# Altium schematic sheet ARCHITECTURE.SchDoc: Architecture
size 420 x 297 mm; SheetNumber: 1
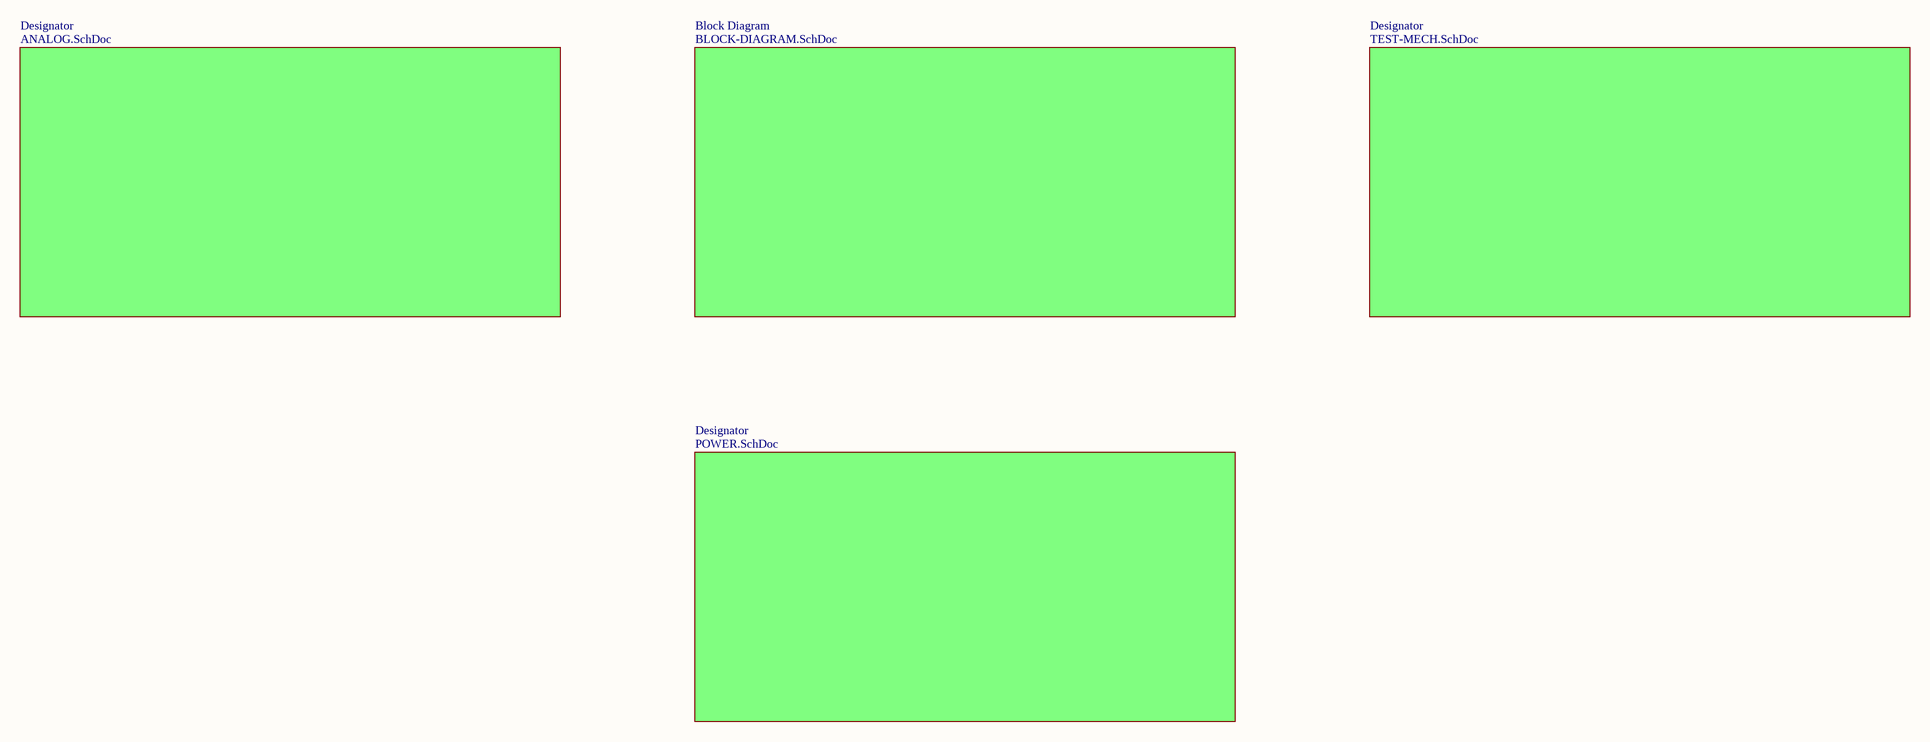
[diagram p0: ARCHITECTURE.SchDoc]

## Sub-sheets
Block Diagram = BLOCK-DIAGRAM.SchDoc: no entries
Designator = TEST-MECH.SchDoc: no entries
Designator = ANALOG.SchDoc: no entries
Designator = POWER.SchDoc: no entries

## Notes on the sheet
- PROJECT
- SIZE
- FILE NAME
- A3
- TITLE
- SHEET
- OF
- REV